# Altium schematic sheet 2019-07-21_05-52-011.schdoc
size 504 x 148 mm; SheetNumber: 1; SheetTotal: 1
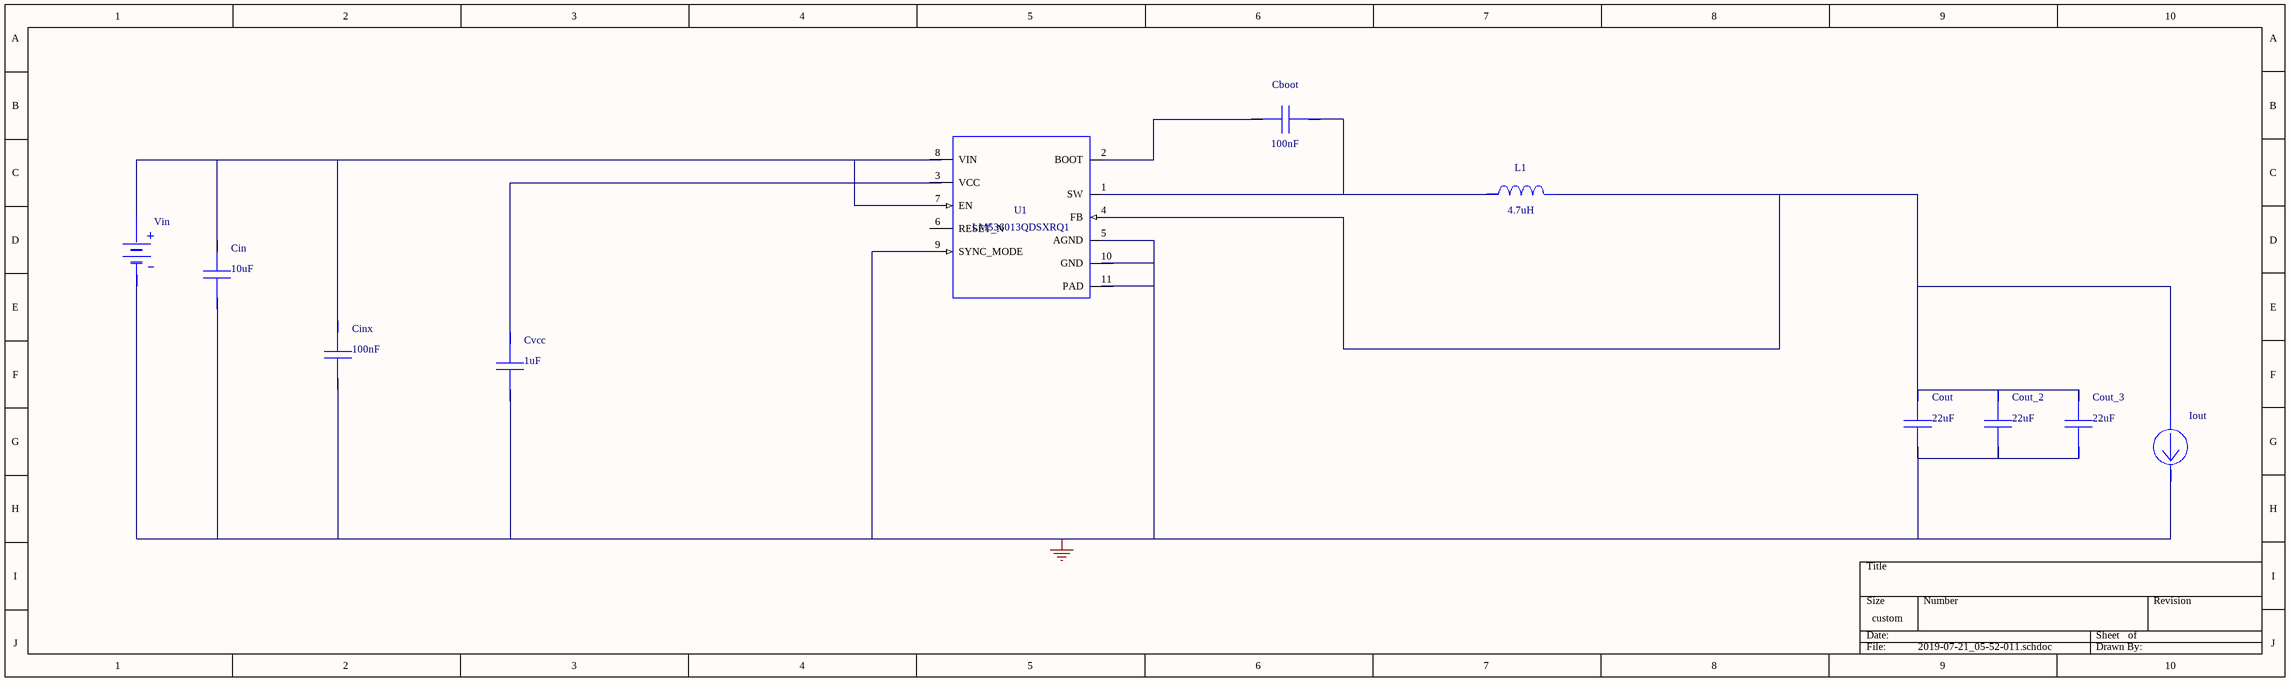
[diagram p0: 2019-07-21_05-52-011.schdoc]

## Parts
Cboot  value 100nF  (hidden comment: C0805C104M5RACTU)
Cin  value 10uF  (hidden comment: C3225X7R1H106M250AC)
Cinx  value 100nF  (hidden comment: CGA3E2X7R1H104K080AA)
Cout  value 22uF  (hidden comment: GRM32ER61C226ME20L)
Cout_2  value 22uF  (hidden comment: GRM32ER61C226ME20L)
Cout_3  value 22uF  (hidden comment: GRM32ER61C226ME20L)
Cvcc  value 1uF  (hidden comment: C0603C105Z8VACTU)
Iout  WB_CURRENT_LOAD  (value not drawn)
L1  value 4.7uH  (hidden comment: SDR0403-4R7ML)
U1  LM536013QDSXRQ1
Vin  WB_BATTERY  (value not drawn)

## Nets
0: Cin.2 Cinx.2 Cout.2 Cout_2.2 Cout_3.2 Cvcc.2 Iout.2(-) U1.5(AGND) U1.9(SYNC_MODE) U1.10(GND) U1.11(PAD) Vin.2(-)
NetCboot_1: Cboot.1 U1.2(BOOT)
NetCboot_2: Cboot.2 L1.1 U1.1(SW)
NetCin_1: Cin.1 Cinx.1 U1.7(EN) U1.8(VIN) Vin.1(+)
NetCout_1: Cout.1 Cout_2.1 Cout_3.1 Iout.1(+) L1.2 U1.4(FB)
NetCvcc_1: Cvcc.1 U1.3(VCC)

Not connected (* = marked no-connect by the designer): U1 6(RESET_N)

## Library data of the parts
Cboot = C0805C104M5RACTU: Manufacturer Name: Kemet; PackageReference: C0805C104M5RACTU; Manufacturer Part Number: C0805C104M5RACTU
Cin = C3225X7R1H106M250AC: C3225X7R1H106M25; Manufacturer Name: TDK; PackageReference: C3225X7R1H106M250AC; Manufacturer Part Number: C3225X7R1H106M250AC
Cinx = CGA3E2X7R1H104K080AA: CGA3E2X7R1H104K0; Manufacturer Name: TDK; PackageReference: CGA3E2X7R1H104K080AA; Manufacturer Part Number: CGA3E2X7R1H104K080AA
Cout Cout_2 Cout_3 = GRM32ER61C226ME20L: GRM32ER61C226ME2; Manufacturer Name: MuRata; PackageReference: GRM32ER61C226ME20L; Manufacturer Part Number: GRM32ER61C226ME20L
Cvcc = C0603C105Z8VACTU: Manufacturer Name: Kemet; PackageReference: C0603C105Z8VACTU; Manufacturer Part Number: C0603C105Z8VACTU
L1 = SDR0403-4R7ML: Manufacturer Name: Bourns; PackageReference: SDR0403-4R7ML; Manufacturer Part Number: SDR0403-4R7ML
U1 = LM536013QDSXRQ1: Manufacturer Name: Texas Instruments; PackageReference: LM536013QDSXRQ1; Manufacturer Part Number: LM536013QDSXRQ1; Value: N/A
Iout = WB_CURRENT_LOAD: PackageReference: WB_CURRENT_LOAD; Manufacturer Part Number: WB_CURRENT_LOAD; Manufacturer Name: WB_CURRENT_LOAD; Value: N/A
Vin = WB_BATTERY: PackageReference: WB_BATTERY; Manufacturer Part Number: WB_BATTERY; Manufacturer Name: WB_BATTERY; Value: N/A